# Altium schematic sheet main.SchDoc
size OrCAD E
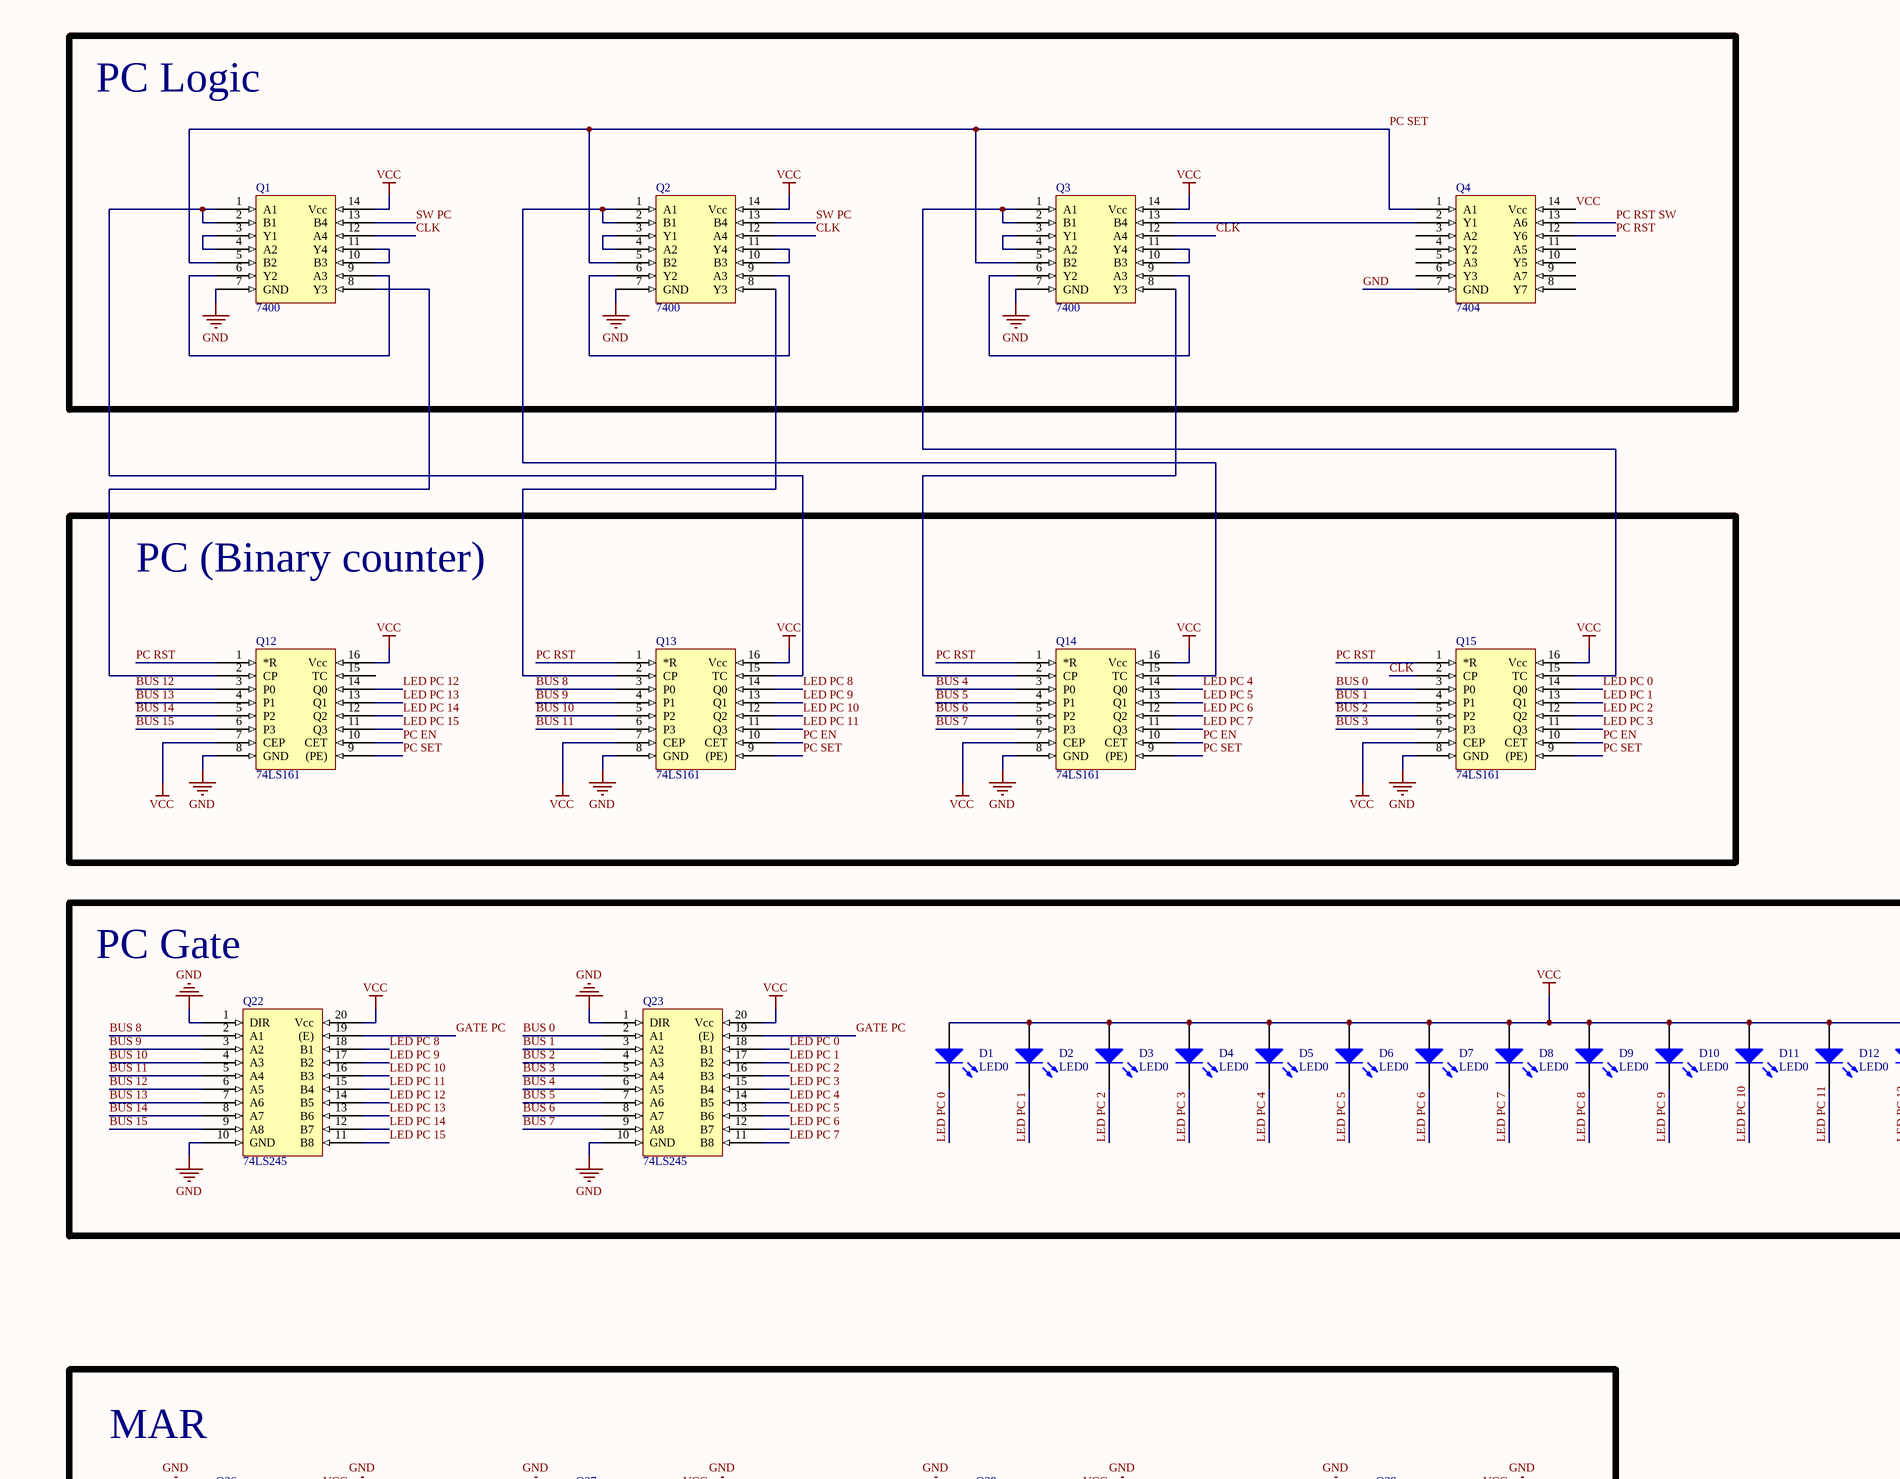
[diagram p0: main.SchDoc, top left]
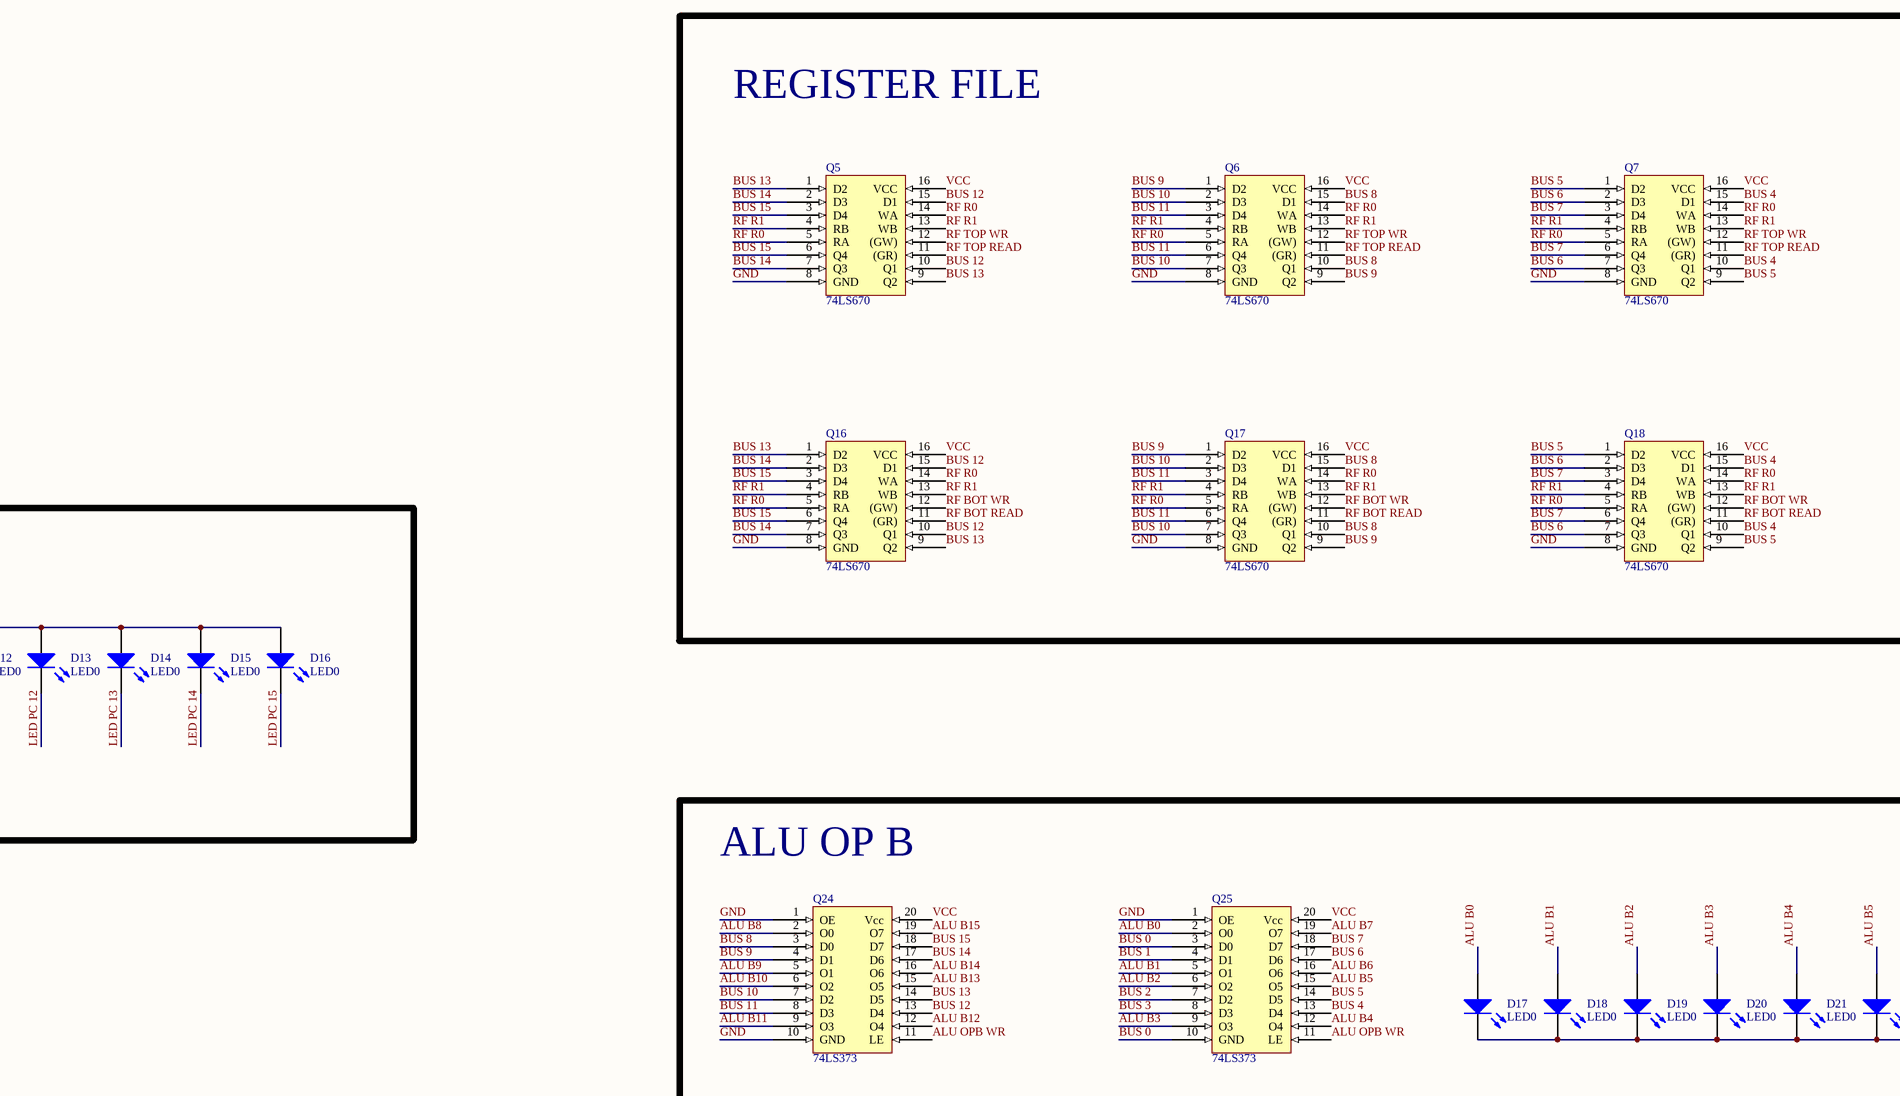
[diagram p1: main.SchDoc, top middle]
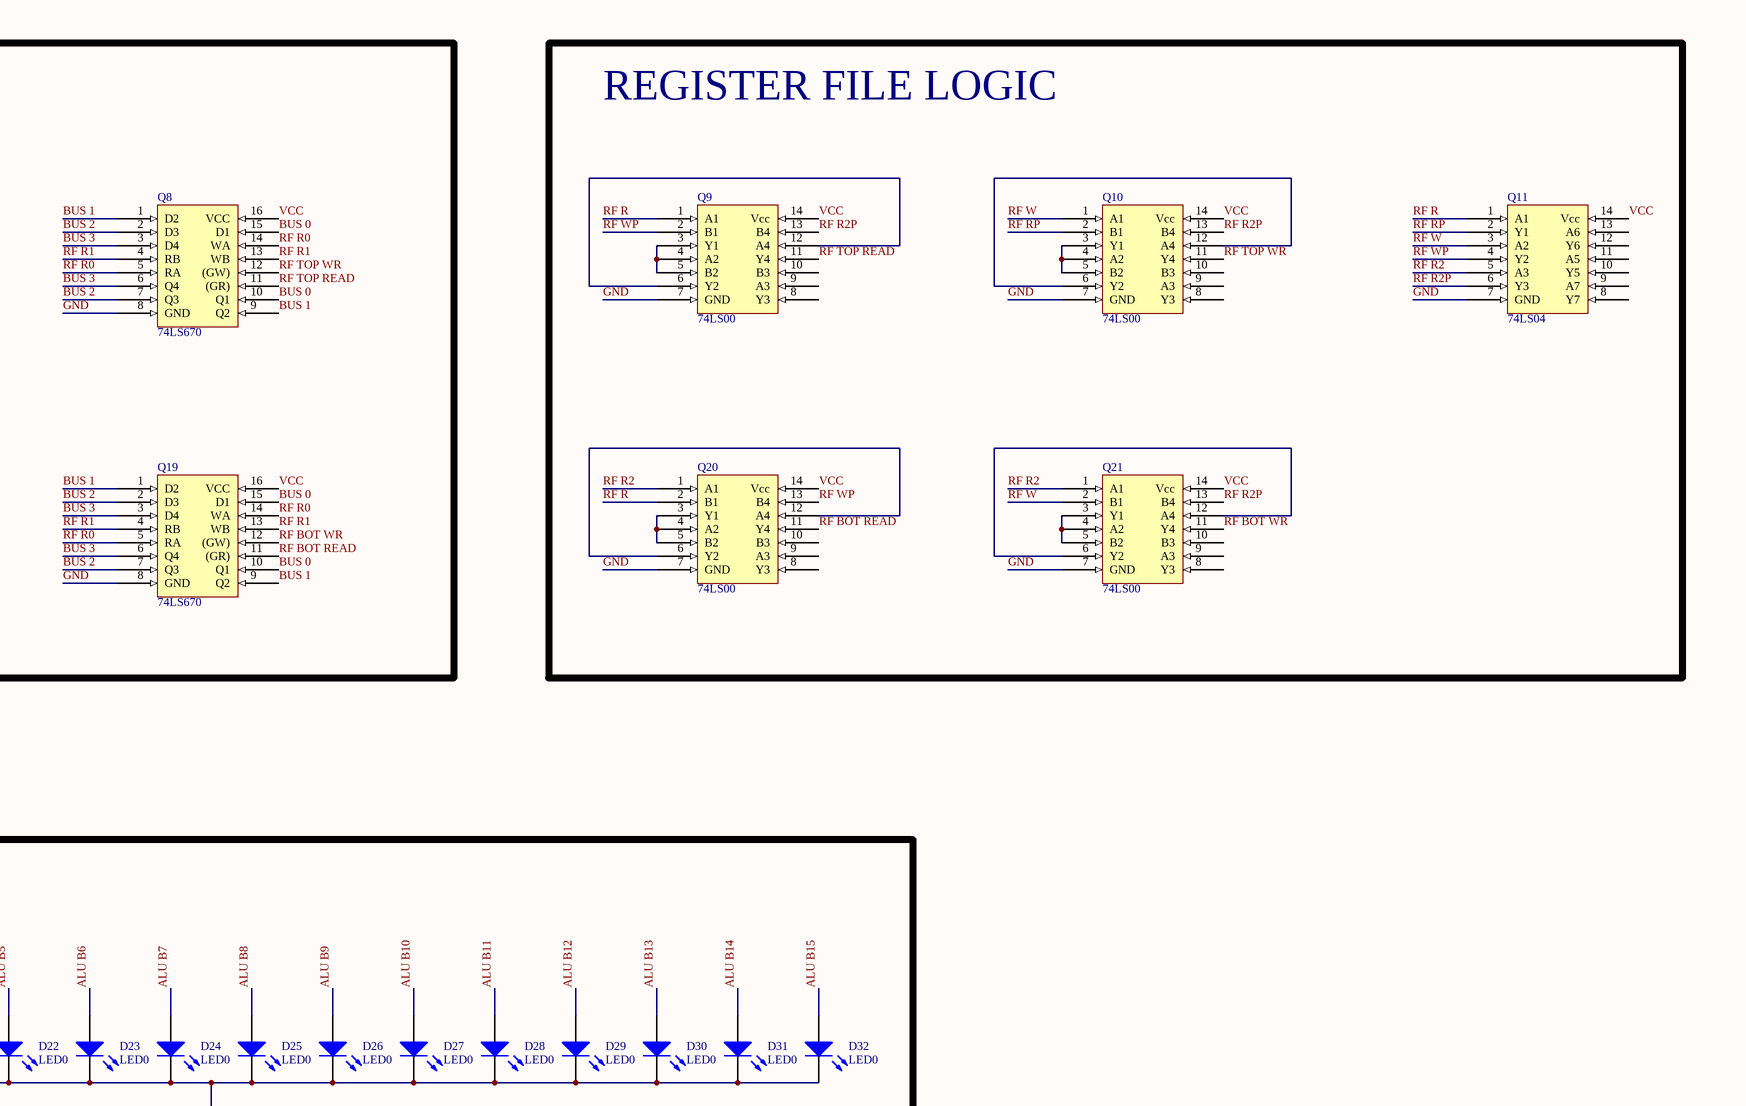
[diagram p2: main.SchDoc, top right]
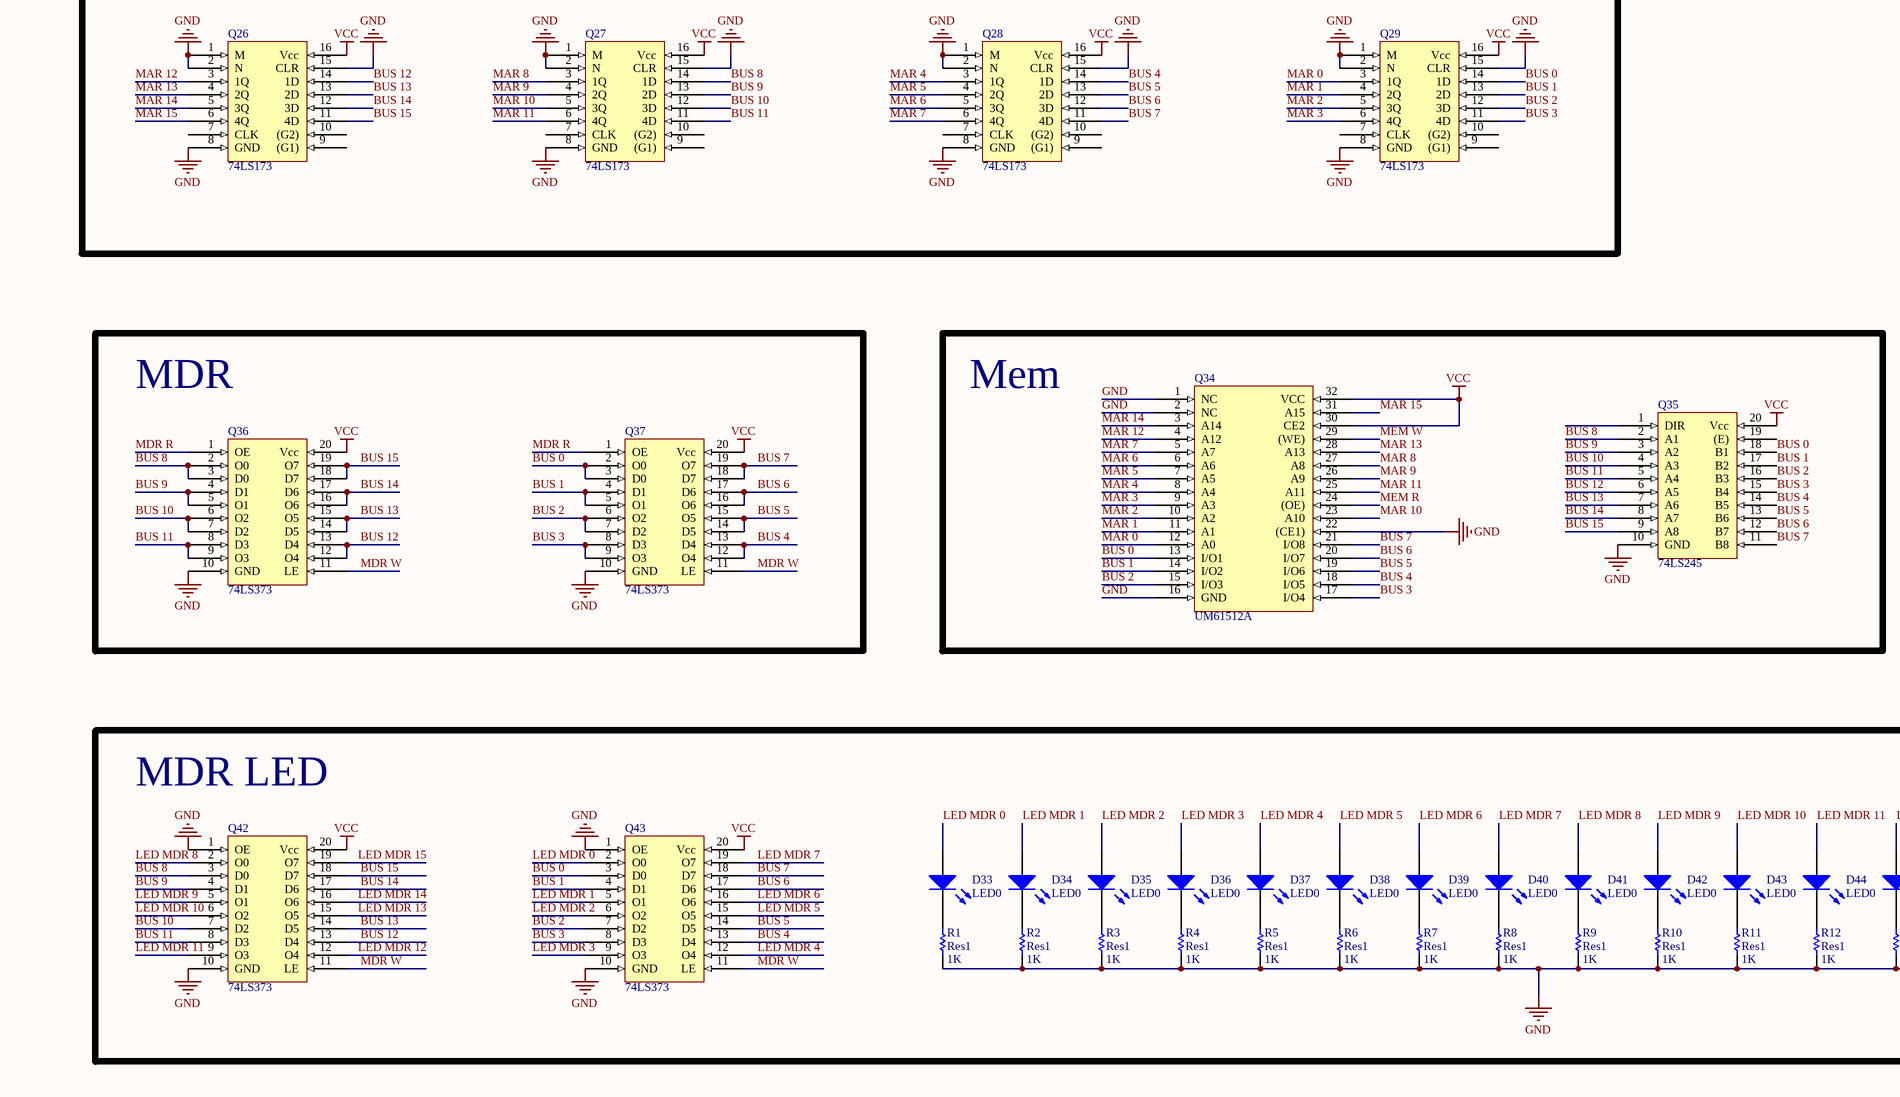
[diagram p3: main.SchDoc, centre left]
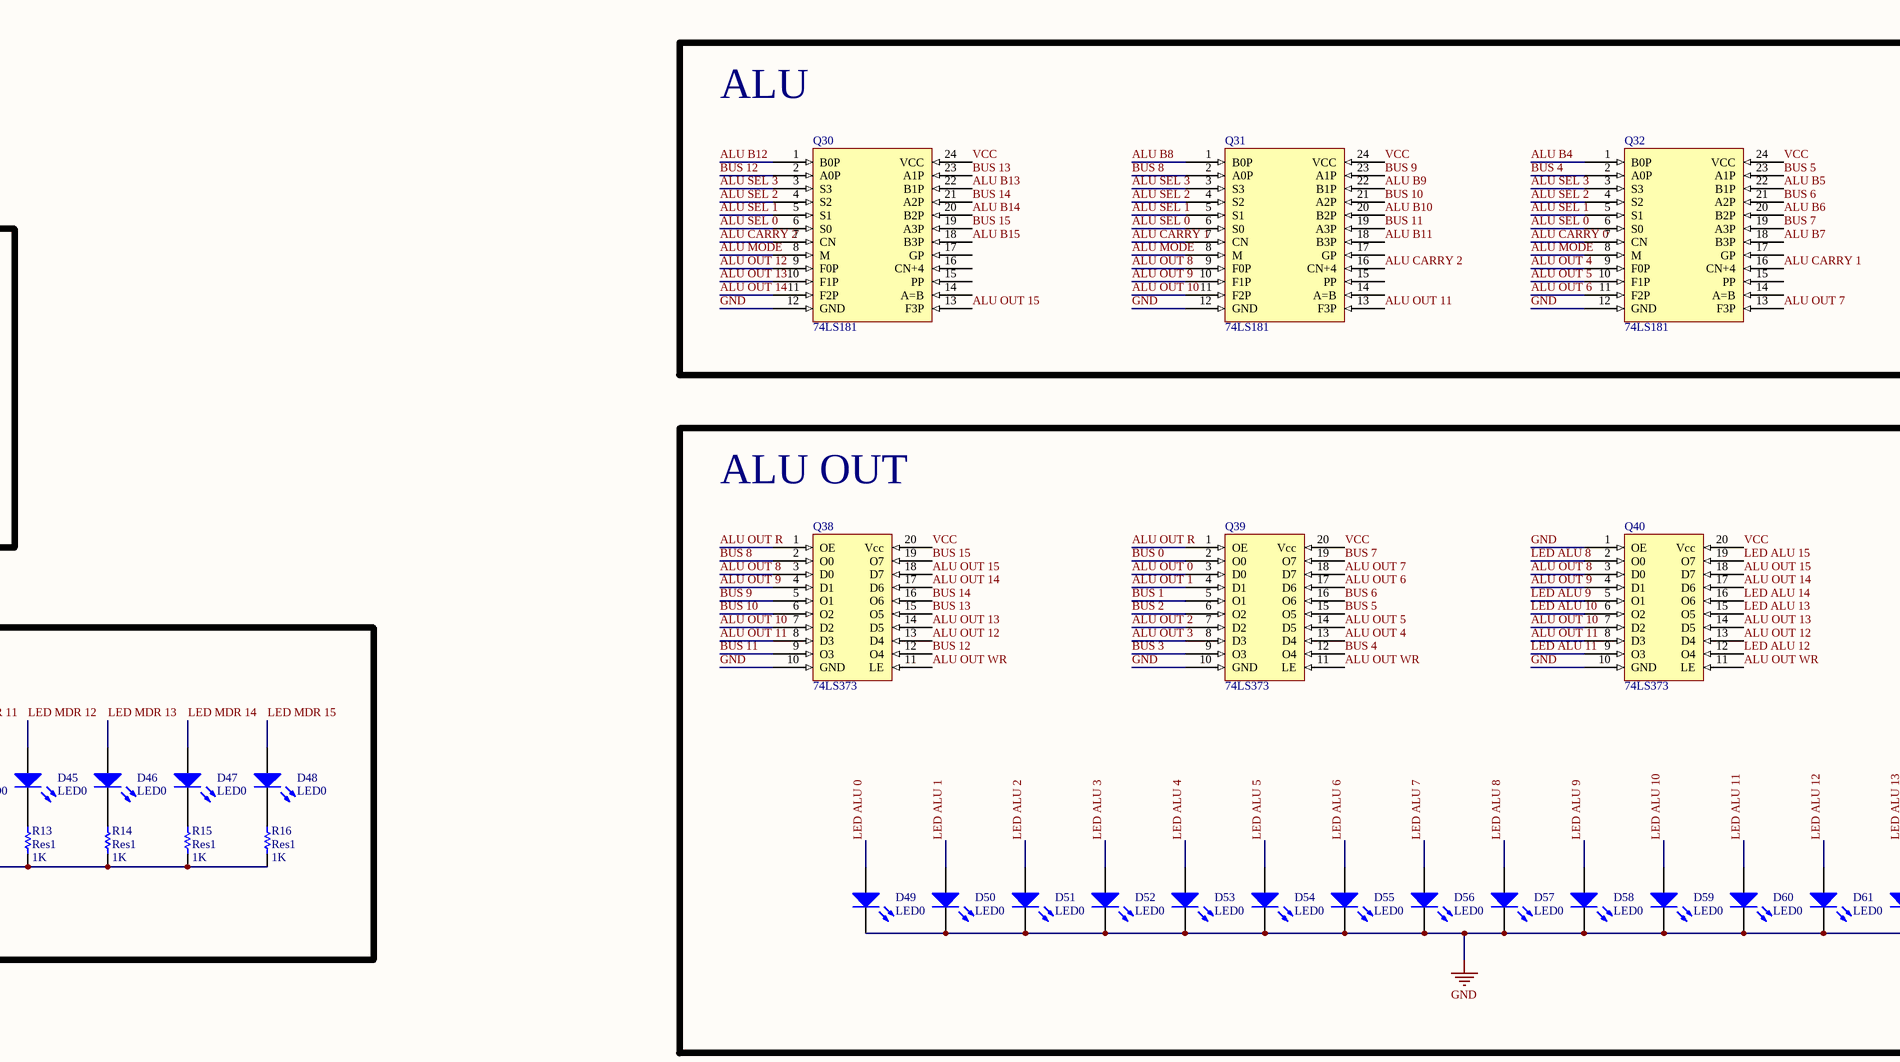
[diagram p4: main.SchDoc, centre middle]
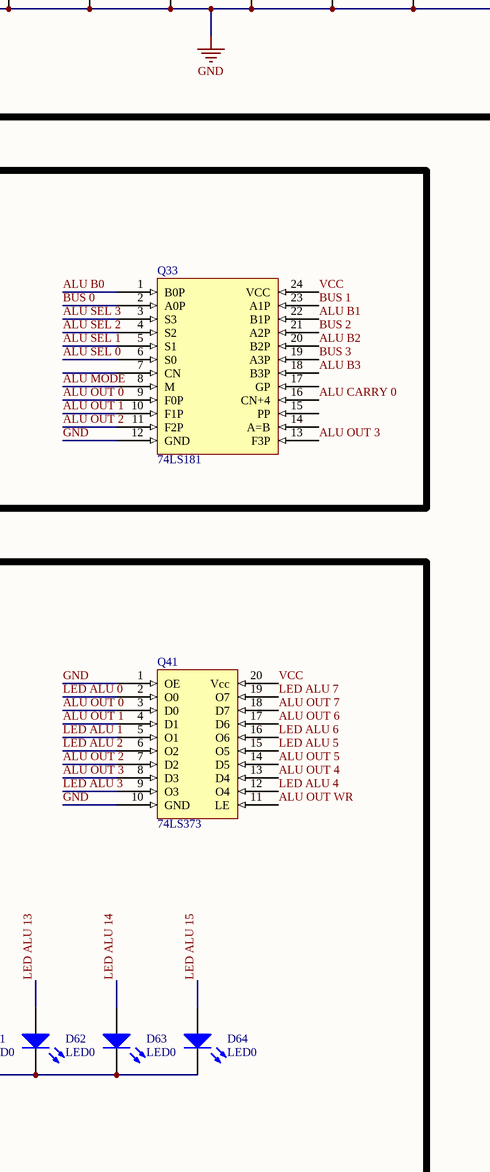
[diagram p5: main.SchDoc, centre right]
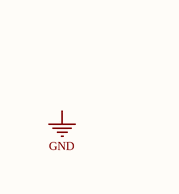
[diagram p6: main.SchDoc, bottom left]
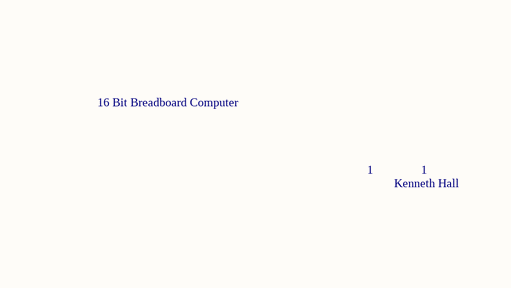
[diagram p7: main.SchDoc, bottom right]

## Parts
D1  LED0  [LED-0]
D2  LED0  [LED-0]
D3  LED0  [LED-0]
D4  LED0  [LED-0]
D5  LED0  [LED-0]
D6  LED0  [LED-0]
D7  LED0  [LED-0]
D8  LED0  [LED-0]
D9  LED0  [LED-0]
D10  LED0  [LED-0]
D11  LED0  [LED-0]
D12  LED0  [LED-0]
D13  LED0  [LED-0]
D14  LED0  [LED-0]
D15  LED0  [LED-0]
D16  LED0  [LED-0]
D17  LED0  [LED-0]
D18  LED0  [LED-0]
D19  LED0  [LED-0]
D20  LED0  [LED-0]
D21  LED0  [LED-0]
D22  LED0  [LED-0]
D23  LED0  [LED-0]
D24  LED0  [LED-0]
D25  LED0  [LED-0]
D26  LED0  [LED-0]
D27  LED0  [LED-0]
D28  LED0  [LED-0]
D29  LED0  [LED-0]
D30  LED0  [LED-0]
D31  LED0  [LED-0]
D32  LED0  [LED-0]
D33  LED0  [LED-0]
D34  LED0  [LED-0]
D35  LED0  [LED-0]
D36  LED0  [LED-0]
D37  LED0  [LED-0]
D38  LED0  [LED-0]
D39  LED0  [LED-0]
D40  LED0  [LED-0]
D41  LED0  [LED-0]
D42  LED0  [LED-0]
D43  LED0  [LED-0]
D44  LED0  [LED-0]
D45  LED0  [LED-0]
D46  LED0  [LED-0]
D47  LED0  [LED-0]
D48  LED0  [LED-0]
D49  LED0  [LED-0]
D50  LED0  [LED-0]
D51  LED0  [LED-0]
D52  LED0  [LED-0]
D53  LED0  [LED-0]
D54  LED0  [LED-0]
D55  LED0  [LED-0]
D56  LED0  [LED-0]
D57  LED0  [LED-0]
D58  LED0  [LED-0]
D59  LED0  [LED-0]
D60  LED0  [LED-0]
D61  LED0  [LED-0]
D62  LED0  [LED-0]
D63  LED0  [LED-0]
D64  LED0  [LED-0]
Q1  7400  [DIP14]
Q2  7400  [DIP14]
Q3  7400  [DIP14]
Q4  7404  [DIP14]
Q5  74LS670  [DIP16]
Q6  74LS670  [DIP16]
Q7  74LS670  [DIP16]
Q8  74LS670  [DIP16]
Q9  74LS00  [DIP14]
Q10  74LS00  [DIP14]
Q11  74LS04  [DIP14]
Q12  74LS161  [DIP16]
Q13  74LS161  [DIP16]
Q14  74LS161  [DIP16]
Q15  74LS161  [DIP16]
Q16  74LS670  [DIP16]
Q17  74LS670  [DIP16]
Q18  74LS670  [DIP16]
Q19  74LS670  [DIP16]
Q20  74LS00  [DIP14]
Q21  74LS00  [DIP14]
Q22  74LS245  [DIP20]
Q23  74LS245  [DIP20]
Q24  74LS373  [DIP20]
Q25  74LS373  [DIP20]
Q26  74LS173  [DIP16]
Q27  74LS173  [DIP16]
Q28  74LS173  [DIP16]
Q29  74LS173  [DIP16]
Q30  74LS181  [DIP24]
Q31  74LS181  [DIP24]
Q32  74LS181  [DIP24]
Q33  74LS181  [DIP24]
Q34  UM61512A  [DIP32]
Q35  74LS245  [DIP20]
Q36  74LS373  [DIP20]
Q37  74LS373  [DIP20]
Q38  74LS373  [DIP20]
Q39  74LS373  [DIP20]
Q40  74LS373  [DIP20]
Q41  74LS373  [DIP20]
Q42  74LS373  [DIP20]
Q43  74LS373  [DIP20]
R1  Res1  value 1K  [AXIAL-0.3]
R2  Res1  value 1K  [AXIAL-0.3]
R3  Res1  value 1K  [AXIAL-0.3]
R4  Res1  value 1K  [AXIAL-0.3]
R5  Res1  value 1K  [AXIAL-0.3]
R6  Res1  value 1K  [AXIAL-0.3]
R7  Res1  value 1K  [AXIAL-0.3]
R8  Res1  value 1K  [AXIAL-0.3]
R9  Res1  value 1K  [AXIAL-0.3]
R10  Res1  value 1K  [AXIAL-0.3]
R11  Res1  value 1K  [AXIAL-0.3]
R12  Res1  value 1K  [AXIAL-0.3]
R13  Res1  value 1K  [AXIAL-0.3]
R14  Res1  value 1K  [AXIAL-0.3]
R15  Res1  value 1K  [AXIAL-0.3]
R16  Res1  value 1K  [AXIAL-0.3]

## Blocks framed on the sheet
PC Logic: Q1-Q4
REGISTER FILE: Q5-Q8 Q16-Q19
REGISTER FILE LOGIC: Q9-Q11 Q20 Q21
PC (Binary counter): Q12-Q15
PC Gate: D1-D16 Q22 Q23
ALU OP B: D17-D32 Q24 Q25
MAR: Q26-Q29
ALU: Q30-Q33
MDR: Q36 Q37
Mem: Q34 Q35
ALU OUT: D49-D64 Q38-Q41
MDR LED: D33-D48 Q42 Q43 R1-R16

## Nets
GND: D17.2(K) D18.2(K) D19.2(K) D20.2(K) D21.2(K) D22.2(K) D23.2(K) D24.2(K) D25.2(K) D26.2(K) D27.2(K) D28.2(K) D29.2(K) D30.2(K) D31.2(K) D32.2(K) D49.2(K) D50.2(K) D51.2(K) D52.2(K) D53.2(K) D54.2(K) D55.2(K) D56.2(K) D57.2(K) D58.2(K) D59.2(K) D60.2(K) D61.2(K) D62.2(K) D63.2(K) D64.2(K) Q1.7(GND) Q2.7(GND) Q3.7(GND) Q4.7(GND) Q5.8(GND) Q6.8(GND) Q7.8(GND) Q8.8(GND) Q9.7(GND) Q10.7(GND) Q11.7(GND) Q12.8(GND) Q13.8(GND) Q14.8(GND) Q15.8(GND) Q16.8(GND) Q17.8(GND) Q18.8(GND) Q19.8(GND) Q20.7(GND) Q21.7(GND) Q22.1(DIR) Q22.10(GND) Q23.1(DIR) Q23.10(GND) Q24.1(OE) Q24.10(GND) Q25.1(OE) Q26.1(M) Q26.2(N) Q26.8(GND) Q26.15(CLR) Q27.1(M) Q27.2(N) Q27.8(GND) Q27.15(CLR) Q28.1(M) Q28.2(N) Q28.8(GND) Q28.15(CLR) Q29.1(M) Q29.2(N) Q29.8(GND) Q29.15(CLR) Q30.12(GND) Q31.12(GND) Q32.12(GND) Q33.12(GND) Q34.1(NC) Q34.2(NC) Q34.16(GND) Q34.22((CE1)) Q35.10(GND) Q36.10(GND) Q37.10(GND) Q38.10(GND) Q39.10(GND) Q40.1(OE) Q40.10(GND) Q41.1(OE) Q41.10(GND) Q42.1(OE) Q42.10(GND) Q43.1(OE) Q43.10(GND) R1.1 R2.1 R3.1 R4.1 R5.1 R6.1 R7.1 R8.1 R9.1 R10.1 R11.1 R12.1 R13.1 R14.1 R15.1 R16.1
VCC: D1.1(A) D2.1(A) D3.1(A) D4.1(A) D5.1(A) D6.1(A) D7.1(A) D8.1(A) D9.1(A) D10.1(A) D11.1(A) D12.1(A) D13.1(A) D14.1(A) D15.1(A) D16.1(A) Q1.14(Vcc) Q2.14(Vcc) Q3.14(Vcc) Q4.14(Vcc) Q5.16(VCC) Q6.16(VCC) Q7.16(VCC) Q8.16(VCC) Q9.14(Vcc) Q10.14(Vcc) Q11.14(Vcc) Q12.7(CEP) Q12.16(Vcc) Q13.7(CEP) Q13.16(Vcc) Q14.7(CEP) Q14.16(Vcc) Q15.7(CEP) Q15.16(Vcc) Q16.16(VCC) Q17.16(VCC) Q18.16(VCC) Q19.16(VCC) Q20.14(Vcc) Q21.14(Vcc) Q22.20(Vcc) Q23.20(Vcc) Q24.20(Vcc) Q25.20(Vcc) Q26.16(Vcc) Q27.16(Vcc) Q28.16(Vcc) Q29.16(Vcc) Q30.24(VCC) Q31.24(VCC) Q32.24(VCC) Q33.24(VCC) Q34.30(CE2) Q34.32(VCC) Q35.20(Vcc) Q36.20(Vcc) Q37.20(Vcc) Q38.20(Vcc) Q39.20(Vcc) Q40.20(Vcc) Q41.20(Vcc) Q42.20(Vcc) Q43.20(Vcc)
ALU B0: D17.1(A) Q25.2(O0) Q33.1(B0P)
ALU B1: D18.1(A) Q25.5(O1) Q33.22(B1P)
ALU B2: D19.1(A) Q25.6(O2) Q33.20(B2P)
ALU B3: D20.1(A) Q25.9(O3) Q33.18(B3P)
ALU B4: D21.1(A) Q25.12(O4) Q32.1(B0P)
ALU B5: D22.1(A) Q25.15(O5) Q32.22(B1P)
ALU B6: D23.1(A) Q25.16(O6) Q32.20(B2P)
ALU B7: D24.1(A) Q25.19(O7) Q32.18(B3P)
ALU B8: D25.1(A) Q24.2(O0) Q31.1(B0P)
ALU B9: D26.1(A) Q24.5(O1) Q31.22(B1P)
ALU B10: D27.1(A) Q24.6(O2) Q31.20(B2P)
ALU B11: D28.1(A) Q24.9(O3) Q31.18(B3P)
ALU B12: D29.1(A) Q24.12(O4) Q30.1(B0P)
ALU B13: D30.1(A) Q24.15(O5) Q30.22(B1P)
ALU B14: D31.1(A) Q24.16(O6) Q30.20(B2P)
ALU B15: D32.1(A) Q24.19(O7) Q30.18(B3P)
ALU CARRY 0: Q32.7(CN) Q33.16(CN+4)
ALU CARRY 1: Q31.7(CN) Q32.16(CN+4)
ALU CARRY 2: Q30.7(CN) Q31.16(CN+4)
ALU MODE: Q30.8(M) Q31.8(M) Q32.8(M) Q33.8(M)
ALU OPB WR: Q24.11(LE) Q25.11(LE)
ALU OUT 0: Q33.9(F0P) Q39.3(D0) Q41.3(D0)
ALU OUT 1: Q33.10(F1P) Q39.4(D1) Q41.4(D1)
ALU OUT 2: Q33.11(F2P) Q39.7(D2) Q41.7(D2)
ALU OUT 3: Q33.13(F3P) Q39.8(D3) Q41.8(D3)
ALU OUT 4: Q32.9(F0P) Q39.13(D4) Q41.13(D4)
ALU OUT 5: Q32.10(F1P) Q39.14(D5) Q41.14(D5)
ALU OUT 6: Q32.11(F2P) Q39.17(D6) Q41.17(D6)
ALU OUT 7: Q32.13(F3P) Q39.18(D7) Q41.18(D7)
ALU OUT 8: Q31.9(F0P) Q38.3(D0) Q40.3(D0)
ALU OUT 9: Q31.10(F1P) Q38.4(D1) Q40.4(D1)
ALU OUT 10: Q31.11(F2P) Q38.7(D2) Q40.7(D2)
ALU OUT 11: Q31.13(F3P) Q38.8(D3) Q40.8(D3)
ALU OUT 12: Q30.9(F0P) Q38.13(D4) Q40.13(D4)
ALU OUT 13: Q30.10(F1P) Q38.14(D5) Q40.14(D5)
ALU OUT 14: Q30.11(F2P) Q38.17(D6) Q40.17(D6)
ALU OUT 15: Q30.13(F3P) Q38.18(D7) Q40.18(D7)
ALU OUT R: Q38.1(OE) Q39.1(OE)
ALU OUT WR: Q38.11(LE) Q39.11(LE) Q40.11(LE) Q41.11(LE)
ALU SEL 0: Q30.6(S0) Q31.6(S0) Q32.6(S0) Q33.6(S0)
ALU SEL 1: Q30.5(S1) Q31.5(S1) Q32.5(S1) Q33.5(S1)
ALU SEL 2: Q30.4(S2) Q31.4(S2) Q32.4(S2) Q33.4(S2)
ALU SEL 3: Q30.3(S3) Q31.3(S3) Q32.3(S3) Q33.3(S3)
BUS 0: Q8.10(Q1) Q8.15(D1) Q15.3(P0) Q19.10(Q1) Q19.15(D1) Q23.2(A1) Q25.3(D0) Q25.10(GND) Q29.14(1D) Q33.2(A0P) Q34.13(I/O1) Q35.18(B1) Q37.2(O0) Q37.3(D0) Q39.2(O0) Q43.3(D0)
BUS 1: Q8.1(D2) Q8.9(Q2) Q15.4(P1) Q19.1(D2) Q19.9(Q2) Q23.3(A2) Q25.4(D1) Q29.13(2D) Q33.23(A1P) Q34.14(I/O2) Q35.17(B2) Q37.4(D1) Q37.5(O1) Q39.5(O1) Q43.4(D1)
BUS 2: Q8.2(D3) Q8.7(Q3) Q15.5(P2) Q19.2(D3) Q19.7(Q3) Q23.4(A3) Q25.7(D2) Q29.12(3D) Q33.21(A2P) Q34.15(I/O3) Q35.16(B3) Q37.6(O2) Q37.7(D2) Q39.6(O2) Q43.7(D2)
BUS 3: Q8.3(D4) Q8.6(Q4) Q15.6(P3) Q19.3(D4) Q19.6(Q4) Q23.5(A4) Q25.8(D3) Q29.11(4D) Q33.19(A3P) Q34.17(I/O4) Q35.15(B4) Q37.8(D3) Q37.9(O3) Q39.9(O3) Q43.8(D3)
BUS 4: Q7.10(Q1) Q7.15(D1) Q14.3(P0) Q18.10(Q1) Q18.15(D1) Q23.6(A5) Q25.13(D4) Q28.14(1D) Q32.2(A0P) Q34.18(I/O5) Q35.14(B5) Q37.12(O4) Q37.13(D4) Q39.12(O4) Q43.13(D4)
BUS 5: Q7.1(D2) Q7.9(Q2) Q14.4(P1) Q18.1(D2) Q18.9(Q2) Q23.7(A6) Q25.14(D5) Q28.13(2D) Q32.23(A1P) Q34.19(I/O6) Q35.13(B6) Q37.14(D5) Q37.15(O5) Q39.15(O5) Q43.14(D5)
BUS 6: Q7.2(D3) Q7.7(Q3) Q14.5(P2) Q18.2(D3) Q18.7(Q3) Q23.8(A7) Q25.17(D6) Q28.12(3D) Q32.21(A2P) Q34.20(I/O7) Q35.12(B7) Q37.16(O6) Q37.17(D6) Q39.16(O6) Q43.17(D6)
BUS 7: Q7.3(D4) Q7.6(Q4) Q14.6(P3) Q18.3(D4) Q18.6(Q4) Q23.9(A8) Q25.18(D7) Q28.11(4D) Q32.19(A3P) Q34.21(I/O8) Q35.11(B8) Q37.18(D7) Q37.19(O7) Q39.19(O7) Q43.18(D7)
BUS 8: Q6.10(Q1) Q6.15(D1) Q13.3(P0) Q17.10(Q1) Q17.15(D1) Q22.2(A1) Q24.3(D0) Q27.14(1D) Q31.2(A0P) Q35.2(A1) Q36.2(O0) Q36.3(D0) Q38.2(O0) Q42.3(D0)
BUS 9: Q6.1(D2) Q6.9(Q2) Q13.4(P1) Q17.1(D2) Q17.9(Q2) Q22.3(A2) Q24.4(D1) Q27.13(2D) Q31.23(A1P) Q35.3(A2) Q36.4(D1) Q36.5(O1) Q38.5(O1) Q42.4(D1)
BUS 10: Q6.2(D3) Q6.7(Q3) Q13.5(P2) Q17.2(D3) Q17.7(Q3) Q22.4(A3) Q24.7(D2) Q27.12(3D) Q31.21(A2P) Q35.4(A3) Q36.6(O2) Q36.7(D2) Q38.6(O2) Q42.7(D2)
BUS 11: Q6.3(D4) Q6.6(Q4) Q13.6(P3) Q17.3(D4) Q17.6(Q4) Q22.5(A4) Q24.8(D3) Q27.11(4D) Q31.19(A3P) Q35.5(A4) Q36.8(D3) Q36.9(O3) Q38.9(O3) Q42.8(D3)
BUS 12: Q5.10(Q1) Q5.15(D1) Q12.3(P0) Q16.10(Q1) Q16.15(D1) Q22.6(A5) Q24.13(D4) Q26.14(1D) Q30.2(A0P) Q35.6(A5) Q36.12(O4) Q36.13(D4) Q38.12(O4) Q42.13(D4)
BUS 13: Q5.1(D2) Q5.9(Q2) Q12.4(P1) Q16.1(D2) Q16.9(Q2) Q22.7(A6) Q24.14(D5) Q26.13(2D) Q30.23(A1P) Q35.7(A6) Q36.14(D5) Q36.15(O5) Q38.15(O5) Q42.14(D5)
BUS 14: Q5.2(D3) Q5.7(Q3) Q12.5(P2) Q16.2(D3) Q16.7(Q3) Q22.8(A7) Q24.17(D6) Q26.12(3D) Q30.21(A2P) Q35.8(A7) Q36.16(O6) Q36.17(D6) Q38.16(O6) Q42.17(D6)
BUS 15: Q5.3(D4) Q5.6(Q4) Q12.6(P3) Q16.3(D4) Q16.6(Q4) Q22.9(A8) Q24.18(D7) Q26.11(4D) Q30.19(A3P) Q35.9(A8) Q36.18(D7) Q36.19(O7) Q38.19(O7) Q42.18(D7)
CLK: Q1.12(A4) Q2.12(A4) Q3.12(A4) Q15.2(CP)
GATE PC: Q22.19((E)) Q23.19((E))
LED ALU 0: D49.1(A) Q41.2(O0)
LED ALU 1: D50.1(A) Q41.5(O1)
LED ALU 2: D51.1(A) Q41.6(O2)
LED ALU 3: D52.1(A) Q41.9(O3)
LED ALU 4: D53.1(A) Q41.12(O4)
LED ALU 5: D54.1(A) Q41.15(O5)
LED ALU 6: D55.1(A) Q41.16(O6)
LED ALU 7: D56.1(A) Q41.19(O7)
LED ALU 8: D57.1(A) Q40.2(O0)
LED ALU 9: D58.1(A) Q40.5(O1)
LED ALU 10: D59.1(A) Q40.6(O2)
LED ALU 11: D60.1(A) Q40.9(O3)
LED ALU 12: D61.1(A) Q40.12(O4)
LED ALU 13: D62.1(A) Q40.15(O5)
LED ALU 14: D63.1(A) Q40.16(O6)
LED ALU 15: D64.1(A) Q40.19(O7)
LED MDR 0: D33.1(A) Q43.2(O0)
LED MDR 1: D34.1(A) Q43.5(O1)
LED MDR 2: D35.1(A) Q43.6(O2)
LED MDR 3: D36.1(A) Q43.9(O3)
LED MDR 4: D37.1(A) Q43.12(O4)
LED MDR 5: D38.1(A) Q43.15(O5)
LED MDR 6: D39.1(A) Q43.16(O6)
LED MDR 7: D40.1(A) Q43.19(O7)
LED MDR 8: D41.1(A) Q42.2(O0)
LED MDR 9: D42.1(A) Q42.5(O1)
LED MDR 10: D43.1(A) Q42.6(O2)
LED MDR 11: D44.1(A) Q42.9(O3)
LED MDR 12: D45.1(A) Q42.12(O4)
LED MDR 13: D46.1(A) Q42.15(O5)
LED MDR 14: D47.1(A) Q42.16(O6)
LED MDR 15: D48.1(A) Q42.19(O7)
LED PC 0: D1.2(K) Q15.14(Q0) Q23.18(B1)
LED PC 1: D2.2(K) Q15.13(Q1) Q23.17(B2)
LED PC 2: D3.2(K) Q15.12(Q2) Q23.16(B3)
LED PC 3: D4.2(K) Q15.11(Q3) Q23.15(B4)
LED PC 4: D5.2(K) Q14.14(Q0) Q23.14(B5)
LED PC 5: D6.2(K) Q14.13(Q1) Q23.13(B6)
LED PC 6: D7.2(K) Q14.12(Q2) Q23.12(B7)
LED PC 7: D8.2(K) Q14.11(Q3) Q23.11(B8)
LED PC 8: D9.2(K) Q13.14(Q0) Q22.18(B1)
LED PC 9: D10.2(K) Q13.13(Q1) Q22.17(B2)
LED PC 10: D11.2(K) Q13.12(Q2) Q22.16(B3)
LED PC 11: D12.2(K) Q13.11(Q3) Q22.15(B4)
LED PC 12: D13.2(K) Q12.14(Q0) Q22.14(B5)
LED PC 13: D14.2(K) Q12.13(Q1) Q22.13(B6)
LED PC 14: D15.2(K) Q12.12(Q2) Q22.12(B7)
LED PC 15: D16.2(K) Q12.11(Q3) Q22.11(B8)
MAR 0: Q29.3(1Q) Q34.12(A0)
MAR 1: Q29.4(2Q) Q34.11(A1)
MAR 2: Q29.5(3Q) Q34.10(A2)
MAR 3: Q29.6(4Q) Q34.9(A3)
MAR 4: Q28.3(1Q) Q34.8(A4)
MAR 5: Q28.4(2Q) Q34.7(A5)
MAR 6: Q28.5(3Q) Q34.6(A6)
MAR 7: Q28.6(4Q) Q34.5(A7)
MAR 8: Q27.3(1Q) Q34.27(A8)
MAR 9: Q27.4(2Q) Q34.26(A9)
MAR 10: Q27.5(3Q) Q34.23(A10)
MAR 11: Q27.6(4Q) Q34.25(A11)
MAR 12: Q26.3(1Q) Q34.4(A12)
MAR 13: Q26.4(2Q) Q34.28(A13)
MAR 14: Q26.5(3Q) Q34.3(A14)
MAR 15: Q26.6(4Q) Q34.31(A15)
MDR R: Q36.1(OE) Q37.1(OE)
MDR W: Q36.11(LE) Q37.11(LE) Q42.11(LE) Q43.11(LE)
MEM R: Q34.24((OE))
MEM W: Q34.29((WE))
PC EN: Q12.10(CET) Q13.10(CET) Q14.10(CET) Q15.10(CET)
PC RST: Q4.12(Y6) Q12.1(*R) Q13.1(*R) Q14.1(*R) Q15.1(*R)
PC RST SW: Q4.13(A6)
PC SET: Q1.5(B2) Q2.5(B2) Q3.5(B2) Q4.1(A1) Q12.9((PE)) Q13.9((PE)) Q14.9((PE)) Q15.9((PE))
RF BOT READ: Q16.11((GR)) Q17.11((GR)) Q18.11((GR)) Q19.11((GR)) Q20.11(Y4)
RF BOT WR: Q16.12((GW)) Q17.12((GW)) Q18.12((GW)) Q19.12((GW)) Q21.11(Y4)
RF R: Q9.1(A1) Q11.1(A1) Q20.2(B1)
RF R0: Q5.5(RA) Q5.14(WA) Q6.5(RA) Q6.14(WA) Q7.5(RA) Q7.14(WA) Q8.5(RA) Q8.14(WA) Q16.5(RA) Q16.14(WA) Q17.5(RA) Q17.14(WA) Q18.5(RA) Q18.14(WA) Q19.5(RA) Q19.14(WA)
RF R1: Q5.4(RB) Q5.13(WB) Q6.4(RB) Q6.13(WB) Q7.4(RB) Q7.13(WB) Q8.4(RB) Q8.13(WB) Q16.4(RB) Q16.13(WB) Q17.4(RB) Q17.13(WB) Q18.4(RB) Q18.13(WB) Q19.4(RB) Q19.13(WB)
RF R2: Q11.5(A3) Q20.1(A1) Q21.1(A1)
RF R2P: Q9.13(B4) Q10.13(B4) Q11.6(Y3) Q21.13(B4)
RF RP: Q10.2(B1) Q11.2(Y1)
RF TOP READ: Q5.11((GR)) Q6.11((GR)) Q7.11((GR)) Q8.11((GR)) Q9.11(Y4)
RF TOP WR: Q5.12((GW)) Q6.12((GW)) Q7.12((GW)) Q8.12((GW)) Q10.11(Y4)
RF W: Q10.1(A1) Q11.3(A2) Q21.2(B1)
RF WP: Q9.2(B1) Q11.4(Y2) Q20.13(B4)
SW PC: Q1.13(B4) Q2.13(B4)
NetD33_2: D33.2(K) R1.2
NetD34_2: D34.2(K) R2.2
NetD35_2: D35.2(K) R3.2
NetD36_2: D36.2(K) R4.2
NetD37_2: D37.2(K) R5.2
NetD38_2: D38.2(K) R6.2
NetD39_2: D39.2(K) R7.2
NetD40_2: D40.2(K) R8.2
NetD41_2: D41.2(K) R9.2
NetD42_2: D42.2(K) R10.2
NetD43_2: D43.2(K) R11.2
NetD44_2: D44.2(K) R12.2
NetD45_2: D45.2(K) R13.2
NetD46_2: D46.2(K) R14.2
NetD47_2: D47.2(K) R15.2
NetD48_2: D48.2(K) R16.2
NetQ1_1: Q1.1(A1) Q1.2(B1) Q13.15(TC)
NetQ1_3: Q1.3(Y1) Q1.4(A2)
NetQ1_6: Q1.6(Y2) Q1.9(A3)
NetQ1_8: Q1.8(Y3) Q12.2(CP)
NetQ1_10: Q1.10(B3) Q1.11(Y4)
NetQ2_1: Q2.1(A1) Q2.2(B1) Q14.15(TC)
NetQ2_3: Q2.3(Y1) Q2.4(A2)
NetQ2_6: Q2.6(Y2) Q2.9(A3)
NetQ2_8: Q2.8(Y3) Q13.2(CP)
NetQ2_10: Q2.10(B3) Q2.11(Y4)
NetQ3_1: Q3.1(A1) Q3.2(B1) Q15.15(TC)
NetQ3_3: Q3.3(Y1) Q3.4(A2)
NetQ3_6: Q3.6(Y2) Q3.9(A3)
NetQ3_8: Q3.8(Y3) Q14.2(CP)
NetQ3_10: Q3.10(B3) Q3.11(Y4)
NetQ3_13: Q3.13(B4) Q4.2(Y1)
NetQ9_3: Q9.3(Y1) Q9.4(A2) Q9.5(B2)
NetQ9_6: Q9.6(Y2) Q9.12(A4)
NetQ10_3: Q10.3(Y1) Q10.4(A2) Q10.5(B2)
NetQ10_6: Q10.6(Y2) Q10.12(A4)
NetQ20_3: Q20.3(Y1) Q20.4(A2) Q20.5(B2)
NetQ20_6: Q20.6(Y2) Q20.12(A4)
NetQ21_3: Q21.3(Y1) Q21.4(A2) Q21.5(B2)
NetQ21_6: Q21.6(Y2) Q21.12(A4)

Not connected (* = marked no-connect by the designer): Q4 3(A2) 4(Y2) 5(A3) 6(Y3) 8(Y7) 9(A7) 10(Y5) 11(A5); Q9 8(Y3) 9(A3) 10(B3); Q10 8(Y3) 9(A3) 10(B3); Q11 8(Y7) 9(A7) 10(Y5) 11(A5) 12(Y6) 13(A6); Q12 15(TC); Q20 8(Y3) 9(A3) 10(B3); Q21 8(Y3) 9(A3) 10(B3); Q26 7(CLK) 9((G1)) 10((G2)); Q27 7(CLK) 9((G1)) 10((G2)); Q28 7(CLK) 9((G1)) 10((G2)); Q29 7(CLK) 9((G1)) 10((G2)); Q30 14(A=B) 15(PP) 16(CN+4) 17(GP); Q31 14(A=B) 15(PP) 17(GP); Q32 14(A=B) 15(PP) 17(GP); Q33 7(CN) 14(A=B) 15(PP) 17(GP); Q35 1(DIR) 19((E))

## Notes on the sheet
- 16 Bit Breadboard Computer
- 1
- Kenneth Hall
- Labels drawn without touching a wire or pin: GND

## Library data of the parts
D1-D64 = LED0: Typical INFRARED GaAs LED; Published: 8-Jun-2000; LatestRevisionDate: 08-Jul-2005; LatestRevisionNote: Mech Layer 1 removed.; PackageReference: LED-0; Publisher: Altium Limited; PackageDescription: LED; 2 Leads
Q1-Q3 = 7400: 4-BIT BINARY COUNTERS
Q4 = 7404: Hex Inverting Gates
Q5-Q8 Q16-Q19 = 74LS670: 4-BY-4 REGISTER FILES WITH 3-STATE OUTPUTS
Q9 Q10 Q20 Q21 = 74LS00: Quad 2-Input NAND Gate
Q11 = 74LS04: Hex Inverting Gates
Q12-Q15 = 74LS161: 4-BIT BINARY COUNTERS
Q22 Q23 Q35 = 74LS245: OCTAL BUS TRANSCEIVER
Q24 Q25 Q36-Q43 = 74LS373: OCTAL TRANSPARENT LATCH WITH 3-STATE OUTPUTS
Q26-Q29 = 74LS173: 4-BIT D-TYPE REGISTERS WITH 3-STATE OUTPUTS
Q30-Q33 = 74LS181: 4-Bit Arithmetic Logic Unit
Q34 = UM61512A: 64K X 8 BIT HIGH SPEED CMOS SRAM
R1-R16 = Res1: Resistor; Published: 8-Jun-2000; LatestRevisionDate: 17-Jul-2002; LatestRevisionNote: Re-released for DXP Platform.; PackageReference: AXIAL-0.3; Publisher: Altium Limited; PackageDescription: Axial Device, Thru-Hole; 2 Leads; 0.3 in Pin Spacing